# Altium project PRJ-SSDC_meter.PrjPCB
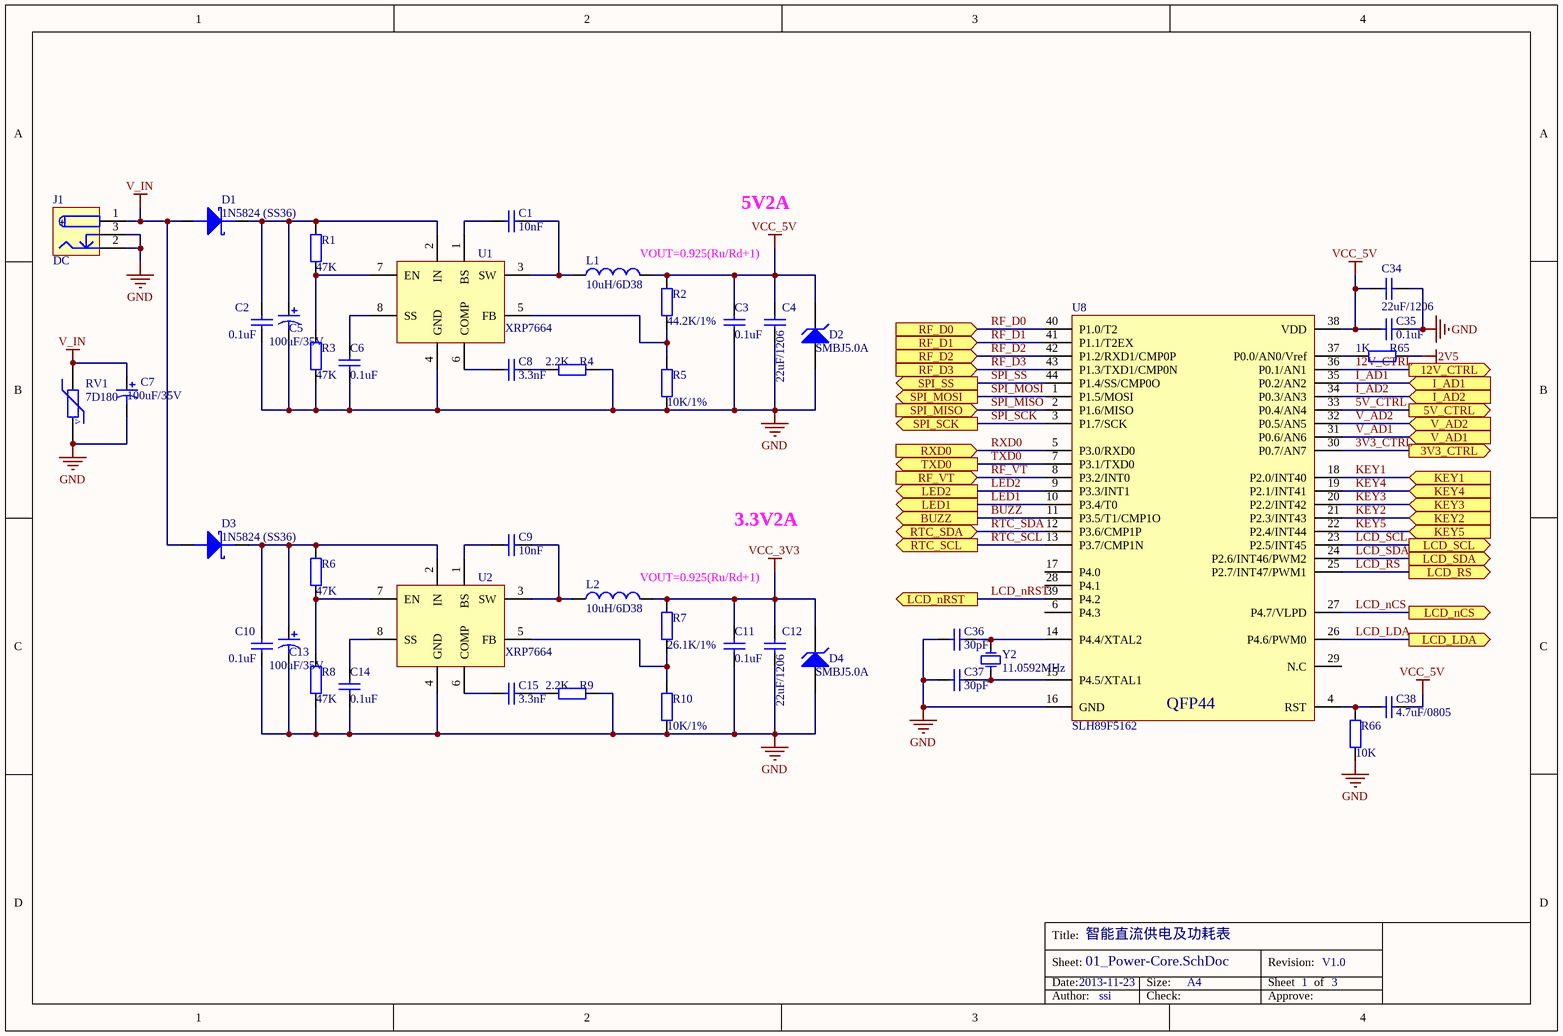
[diagram p0: 01_Power-Core.SchDoc]
3 sheets, 155 parts. Net scope: flat (ports and power ports of the same name join across sheets).
Board file: PCB-SSDCIV_V1.0.PcbDoc
Sheets:
  01_Power-Core.SchDoc
  02_VI-adc.SchDoc
  03_LCD-Other.SchDoc

## Sheet 01_Power-Core.SchDoc
size A4

### Parts
C1  10nF  [0603C]
C2  0.1uF  [0603C]
C3  0.1uF  [0603C]
C4  22uF/1206  [1206]
C5  100uF/35V  [CAP_6.3X11]
C6  0.1uF  [0603C]
C7  100uF/35V  [CAP_6.3X11]
C8  3.3nF  [0603C]
C9  10nF  [0603C]
C10  0.1uF  [0603C]
C11  0.1uF  [0603C]
C12  22uF/1206  [1206]
C13  100uF/35V  [CAP_6.3X11]
C14  0.1uF  [0603C]
C15  3.3nF  [0603C]
C34  22uF/1206  [1206]
C35  0.1uF  [0603C]
C36  30pF  [0603C]
C37  30pF  [0603C]
C38  4.7uF/0805  [0805]
D1  1N5824 (SS36)  [SMA/DO-214AC]
D2  SMBJ5.0A  [SMB/DO-214AB]
D3  1N5824 (SS36)  [SMA/DO-214AC]
D4  SMBJ5.0A  [SMB/DO-214AB]
J1  DC  [DC5.0mm]
L1  10uH/6D38  [INDUCTOR-6D38]
L2  10uH/6D38  [INDUCTOR-6D38]
R1  47K  [0603]
R2  44.2K/1%  [0603]
R3  47K  [0603]
R4  2.2K  [0603]
R5  10K/1%  [0603]
R6  47K  [0603]
R7  26.1K/1%  [0603]
R8  47K  [0603]
R9  2.2K  [0603]
R10  10K/1%  [0603]
R65  1K  [0603]
R66  10K  [0603]
RV1  7D180  [RV2_7D]
U1  XRP7664  [SOIC-8]
U2  XRP7664  [SOIC-8]
U8  SLH89F5162  [LQFP44]
Y2  11.0592MHz  [XTAL]

### Ports
3V3_CTRL (out), 5V_CTRL (out), 12V_CTRL (out), BUZZ (out), I_AD1 (in), I_AD2 (in), KEY1 (in), KEY2 (in), KEY3 (in), KEY4 (in), KEY5 (in), LCD_LDA (out), LCD_nCS (out), LCD_nRST (out), LCD_RS (out), LCD_SCL (out), LCD_SDA (out), LED1 (out), LED2 (out), RF_D0 (in), RF_D1 (in), RF_D2 (in), RF_D3 (in), RF_VT (in), RTC_SCL (out), RTC_SDA (bidir), RXD0 (in), SPI_MISO (in), SPI_MOSI (out), SPI_SCK (out), SPI_SS (out), TXD0 (out), V_AD1 (in), V_AD2 (in)

### Nets
2V5: R65.2
GND: C2.1 C3.1 C4.1 C5.2 C6.1 C7.2 C10.1 C11.1 C12.1 C13.2 C14.1 C34.1 C35.2 C36.1 C37.1 D2.1(A) D4.1(A) J1.2(-) J1.3(W) R3.1 R4.2 R5.1 R8.1 R9.2 R10.1 R66.1 RV1.1 U1.4(GND) U2.4(GND) U8.16(GND)
V_IN: C7.1 D1.1(A) D3.1(A) J1.1(+) RV1.2
VCC_3V3: C11.2 C12.2 D4.2(K) L2.2 R7.2
VCC_5V: C3.2 C4.2 C34.2 C35.1 C38.1 D2.2(K) L1.2 R2.2 U8.38(VDD)
3V3_CTRL: U8.30(P0.7/AN7) ; port 3V3_CTRL
5V_CTRL: U8.33(P0.4/AN4) ; port 5V_CTRL
12V_CTRL: U8.36(P0.1/AN1) ; port 12V_CTRL
BUZZ: U8.11(P3.5/T1/CMP1O) ; port BUZZ
I_AD1: U8.35(P0.2/AN2) ; port I_AD1
I_AD2: U8.34(P0.3/AN3) ; port I_AD2
KEY1: U8.18(P2.0/INT40) ; port KEY1
KEY2: U8.21(P2.3/INT43) ; port KEY2
KEY3: U8.20(P2.2/INT42) ; port KEY3
KEY4: U8.19(P2.1/INT41) ; port KEY4
KEY5: U8.22(P2.4/INT44) ; port KEY5
LCD_LDA: U8.26(P4.6/PWM0) ; port LCD_LDA
LCD_nCS: U8.27(P4.7/VLPD) ; port LCD_nCS
LCD_nRST: U8.39(P4.2) ; port LCD_nRST
LCD_RS: U8.25(P2.7/INT47/PWM1) ; port LCD_RS
LCD_SCL: U8.23(P2.5/INT45) ; port LCD_SCL
LCD_SDA: U8.24(P2.6/INT46/PWM2) ; port LCD_SDA
LED1: U8.10(P3.4/T0) ; port LED1
LED2: U8.9(P3.3/INT1) ; port LED2
RF_D0: U8.40(P1.0/T2) ; port RF_D0
RF_D1: U8.41(P1.1/T2EX) ; port RF_D1
RF_D2: U8.42(P1.2/RXD1/CMP0P) ; port RF_D2
RF_D3: U8.43(P1.3/TXD1/CMP0N) ; port RF_D3
RF_VT: U8.8(P3.2/INT0) ; port RF_VT
RTC_SCL: U8.13(P3.7/CMP1N) ; port RTC_SCL
RTC_SDA: U8.12(P3.6/CMP1P) ; port RTC_SDA
RXD0: U8.5(P3.0/RXD0) ; port RXD0
SPI_MISO: U8.2(P1.6/MISO) ; port SPI_MISO
SPI_MOSI: U8.1(P1.5/MOSI) ; port SPI_MOSI
SPI_SCK: U8.3(P1.7/SCK) ; port SPI_SCK
SPI_SS: U8.44(P1.4/SS/CMP0O) ; port SPI_SS
TXD0: U8.7(P3.1/TXD0) ; port TXD0
V_AD1: U8.31(P0.6/AN6) ; port V_AD1
V_AD2: U8.32(P0.5/AN5) ; port V_AD2
NetC1_1: C1.1 U1.1(BS)
NetC1_2: C1.2 L1.1 U1.3(SW)
NetC2_2: C2.2 C5.1 D1.2(K) R1.2 U1.2(IN)
NetC6_2: C6.2 U1.8(SS)
NetC8_1: C8.1 U1.6(COMP)
NetC8_2: C8.2 R4.1
NetC9_1: C9.1 U2.1(BS)
NetC9_2: C9.2 L2.1 U2.3(SW)
NetC10_2: C10.2 C13.1 D3.2(K) R6.2 U2.2(IN)
NetC14_2: C14.2 U2.8(SS)
NetC15_1: C15.1 U2.6(COMP)
NetC15_2: C15.2 R9.1
NetC36_2: C36.2 U8.14(P4.4/XTAL2) Y2.2(OSC2)
NetC37_2: C37.2 U8.15(P4.5/XTAL1) Y2.1(OSC1)
NetC38_2: C38.2 R66.2 U8.4(RST)
NetR1_1: R1.1 R3.2 U1.7(EN)
NetR2_1: R2.1 R5.2 U1.5(FB)
NetR6_1: R6.1 R8.2 U2.7(EN)
NetR7_1: R7.1 R10.2 U2.5(FB)
NetR65_1: R65.1 U8.37(P0.0/AN0/Vref)

Not connected (* = marked no-connect by the designer): U8 6(P4.3) 17(P4.0) 28(P4.1) 29(N.C)

### Notes on the sheet
- 5V2A
- (near L1) VOUT=0.925(Ru/Rd+1)
- (near L2) VOUT=0.925(Ru/Rd+1)
- 3.3V2A
- 2013-11-23
- 智能直流供电及功耗表
- 1        3
- V1.0
- ssi
- Title:
- Sheet:
- Date:
- Size:
- A4
- Revision:
- Sheet
- of
- Author:
- Check:
- Approve:
- (in symbol RES VDR) V
- (in symbol SLH89F5162_QFP44) QFP44

### Library data of the parts
C1-C4 C6 C8-C12 C14 C15 C34-C38 = Cap: Capacitor; Published: 8-Jun-2000; LatestRevisionDate: 17-Jul-2002; LatestRevisionNote: Re-released for DXP Platform.; PackageReference: RAD-0.3; Publisher: Altium Limited
C5 C7 C13 = Cap2: Capacitor; Published: 23-Sep-2002; PackageReference: CAPR5-4X5; Publisher: Altium Limited
D1 D3 = DIODE_1N582x: Schottky Diode
D2 D4 = DIODE_SMBJxx: Zener Diode; Published: 8-Jun-2000; LatestRevisionDate: 17-Jul-2002; LatestRevisionNote: Re-released for DXP Platform.; PackageReference: DIODE-0.7; Publisher: Altium Limited
J1 = DC_PWR: Low Voltage Power Supply Connector; Published: 17-Dec-2003; DatasheetDocument: 09-May-2002; Publisher: Altium Limited
L1 L2 = Inductor: Code_IEC: 1005; Published: 8-Jun-2000; LatestRevisionDate: 17-Jul-2002; LatestRevisionNote: Re-released for DXP Platform.; PackageReference: 0402-A; Publisher: Altium Limited; Code_JEITA: 0402; Value: Inductor
R1-R10 R65 R66 = Res2: Resistor; Published: 8-Jun-2000; LatestRevisionDate: 17-Jul-2002; LatestRevisionNote: Re-released for DXP Platform.; PackageReference: AXIAL-0.4; Publisher: Altium Limited
RV1 = RES VDR: Varistor (Voltage-Sensitive Resistor) 压敏电阻; Published: 24-Mar-1999; LatestRevisionDate: 04-Mar-2005; LatestRevisionNote: PCB Footprint replaced.; PackageReference: 6-0805; Publisher: Altium Limited
U1 U2 = XRP7664/MP1482: 2A  18V  Synchronous  Step-Down Converter
U8 = SLH89F5162_QFP44
Y2 = XTAL: Crystal Oscillator; Published: 8-Jun-2000; LatestRevisionDate: 17-Jul-2002; LatestRevisionNote: Re-released for DXP Platform.; PackageReference: R38; Publisher: Altium Limited

## Sheet 02_VI-adc.SchDoc
size A4; Organization: Altium Limited; Address1: L3, 12a Rodborough Rd; Address2: Frenchs Forest; Address3: NSW; Address4: Australia 2086
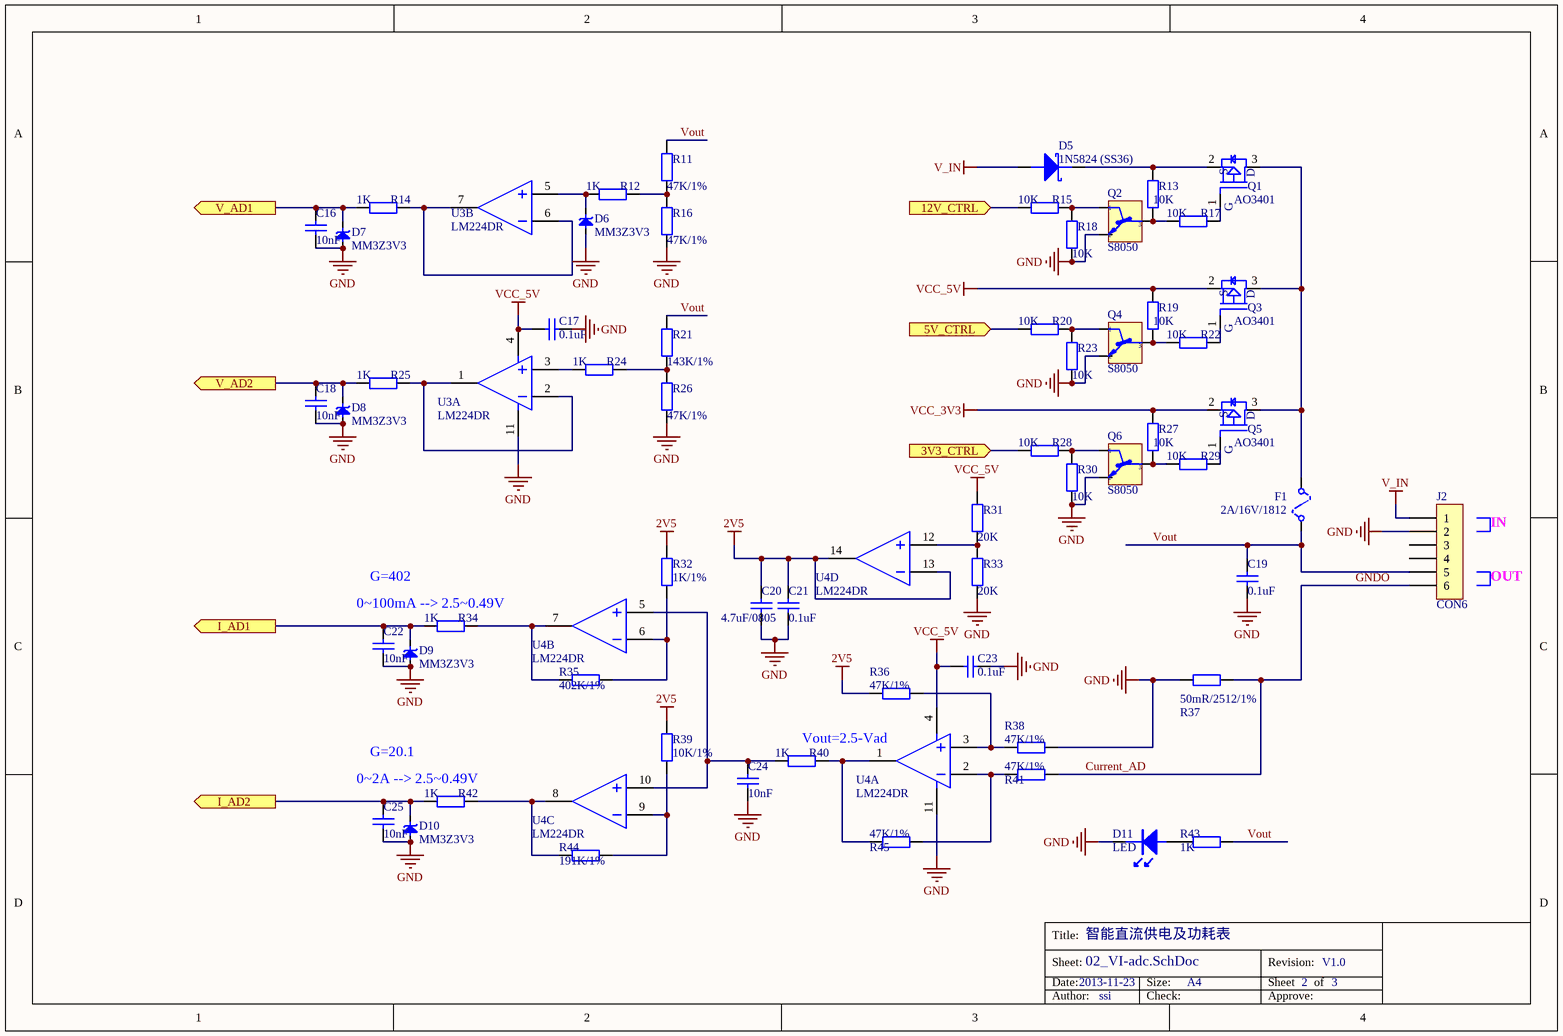
[diagram p1: 02_VI-adc.SchDoc]

### Parts
C16  10nF  [0603C]
C17  0.1uF  [0603C]
C18  10nF  [0603C]
C19  0.1uF  [0603C]
C20  4.7uF/0805  [0805]
C21  0.1uF  [0603C]
C22  10nF  [0603C]
C23  0.1uF  [0603C]
C24  10nF  [0603C]
C25  10nF  [0603C]
D5  1N5824 (SS36)  [SMA/DO-214AC]
D6  MM3Z3V3  [SOD-323]
D7  MM3Z3V3  [SOD-323]
D8  MM3Z3V3  [SOD-323]
D9  MM3Z3V3  [SOD-323]
D10  MM3Z3V3  [SOD-323]
D11  LED  [LED-3.5mm]
F1  2A/16V/1812  [F1812]
J2  CON6  [SIPD6]
Q1  AO3401  [SOT-23]
Q2  S8050  [SOT-23]
Q3  AO3401  [SOT-23]
Q4  S8050  [SOT-23]
Q5  AO3401  [SOT-23]
Q6  S8050  [SOT-23]
R11  47K/1%  [0603]
R12  1K  [0603]
R13  10K  [0603]
R14  1K  [0603]
R15  10K  [0603]
R16  47K/1%  [0603]
R17  10K  [0603]
R18  10K  [0603]
R19  10K  [0603]
R20  10K  [0603]
R21  143K/1%  [0603]
R22  10K  [0603]
R23  10K  [0603]
R24  1K  [0603]
R25  1K  [0603]
R26  47K/1%  [0603]
R27  10K  [0603]
R28  10K  [0603]
R29  10K  [0603]
R30  10K  [0603]
R31  20K  [0603]
R32  1K/1%  [0603]
R33  20K  [0603]
R34  1K  [0603]
R35  402K/1%  [0603]
R36  47K/1%  [0603]
R37  50mR/2512/1%  [2512]
R38  47K/1%  [0603]
R39  10K/1%  [0603]
R40  1K  [0603]
R41  47K/1%  [0603]
R42  1K  [0603]
R43  1K  [0603]
R44  191K/1%  [0603]
R45  47K/1%  [0603]
U3  LM224DR  [SO-14]  (parts A,B of 4)
U4  LM224DR  [SO-14]  (parts A,B,C,D of 4)

### Ports
3V3_CTRL (in), 5V_CTRL (in), 12V_CTRL (in), I_AD1 (out), I_AD2 (out), V_AD1 (out), V_AD2 (out)

### Nets
2V5: C20.2 C21.2 R32.1 R36.1 R39.1 U4.13 U4.14
GND: C16.1 C17.2 C18.1 C19.1 C20.1 C21.1 C22.1 C23.2 C24.1 C25.1 D6.1(A) D7.1(A) D8.1(A) D9.1(A) D10.1(A) D11.2(K) J2.2 Q2.2(E) Q4.2(E) Q6.2(E) R16.1 R18.1 R23.1 R26.1 R30.1 R33.1 R37.1 R38.2 U3.11 U4.11
V_IN: D5.1(A) J2.1
VCC_3V3: Q5.2(S) R27.2
VCC_5V: C17.1 C23.1 Q3.2(S) R19.2 R31.2 U3.4 U4.4
3V3_CTRL: R28.1 ; port 3V3_CTRL
5V_CTRL: R20.1 ; port 5V_CTRL
12V_CTRL: R15.1 ; port 12V_CTRL
Current_AD: J2.6 R37.2 R41.2  [also labelled GNDO]
I_AD1: C22.2 D9.2(K) R34.1 ; port I_AD1
I_AD2: C25.2 D10.2(K) R42.1 ; port I_AD2
V_AD1: C16.2 D7.2(K) R14.1 ; port V_AD1
V_AD2: C18.2 D8.2(K) R25.1 ; port V_AD2
Vout: C19.2 F1.1 J2.5 R11.2 R21.2 R43.2
NetC24_2: C24.2 R40.1 U4.5 U4.10
NetD5_2: D5.2(K) Q1.2(S) R13.2
NetD6_2: D6.2(K) R12.1 U3.5
NetD11_1: D11.1(A) R43.1
NetF1_2: F1.2 Q1.3(D) Q3.3(D) Q5.3(D)
NetQ1_1: Q1.1(G) R17.2
NetQ2_1: Q2.1(B) R15.2 R18.2
NetQ2_3: Q2.3(C) R13.1 R17.1
NetQ3_1: Q3.1(G) R22.2
NetQ4_1: Q4.1(B) R20.2 R23.2
NetQ4_3: Q4.3(C) R19.1 R22.1
NetQ5_1: Q5.1(G) R29.2
NetQ6_1: Q6.1(B) R28.2 R30.2
NetQ6_3: Q6.3(C) R27.1 R29.1
NetR11_1: R11.1 R12.2 R16.2
NetR14_2: R14.2 U3.6 U3.7
NetR21_1: R21.1 R24.2 R26.2
NetR24_1: R24.1 U3.3
NetR25_2: R25.2 U3.1 U3.2
NetR31_1: R31.1 R33.2 U4.12
NetR32_2: R32.2 R35.2 U4.6
NetR34_2: R34.2 R35.1 U4.7
NetR36_2: R36.2 R38.1 U4.3
NetR39_2: R39.2 R44.2 U4.9
NetR40_2: R40.2 R45.1 U4.1
NetR41_1: R41.1 R45.2 U4.2
NetR42_2: R42.2 R44.1 U4.8

Not connected (* = marked no-connect by the designer): J2 3 4

### Notes on the sheet
- G=402
- OUT
- IN
- (near R34) 0~100mA --> 2.5~0.49V
- (near R42) 0~2A --> 2.5~0.49V
- G=20.1
- Vout=2.5-Vad
- 2013-11-23
- 智能直流供电及功耗表
- 2        3
- V1.0
- ssi
- Title:
- Sheet:
- Date:
- Size:
- A4
- Revision:
- Sheet
- of
- Author:
- Check:
- Approve:

### Library data of the parts
C16-C25 = Cap: Capacitor; Published: 8-Jun-2000; LatestRevisionDate: 17-Jul-2002; LatestRevisionNote: Re-released for DXP Platform.; PackageReference: RAD-0.3; Publisher: Altium Limited
D5 = DIODE_1N582x: Schottky Diode
D6-D10 = DIODE_MM3Zxx: Zener Diode; Published: 8-Jun-2000; LatestRevisionDate: 17-Jul-2002; LatestRevisionNote: Re-released for DXP Platform.; PackageReference: DIODE-0.7; Publisher: Altium Limited
F1 = Fuse 3: Fuse; Published: 8-Jun-2000; LatestRevisionDate: 17-Jul-2002; LatestRevisionNote: Re-released for DXP Platform.; PackageReference: PIN-W2/E2.8; Publisher: Altium Limited
Q1 Q3 Q5 = MOS_P_SI2305DS
Q2 Q4 Q6 = NPN_T: NPN
R11-R45 = Res2: Resistor; Published: 8-Jun-2000; LatestRevisionDate: 17-Jul-2002; LatestRevisionNote: Re-released for DXP Platform.; PackageReference: AXIAL-0.4; Publisher: Altium Limited
U3 U4 = LM224

## Sheet 03_LCD-Other.SchDoc
size A4; Organization: Altium Limited; Address1: L3, 12a Rodborough Rd; Address2: Frenchs Forest; Address3: NSW; Address4: Australia 2086
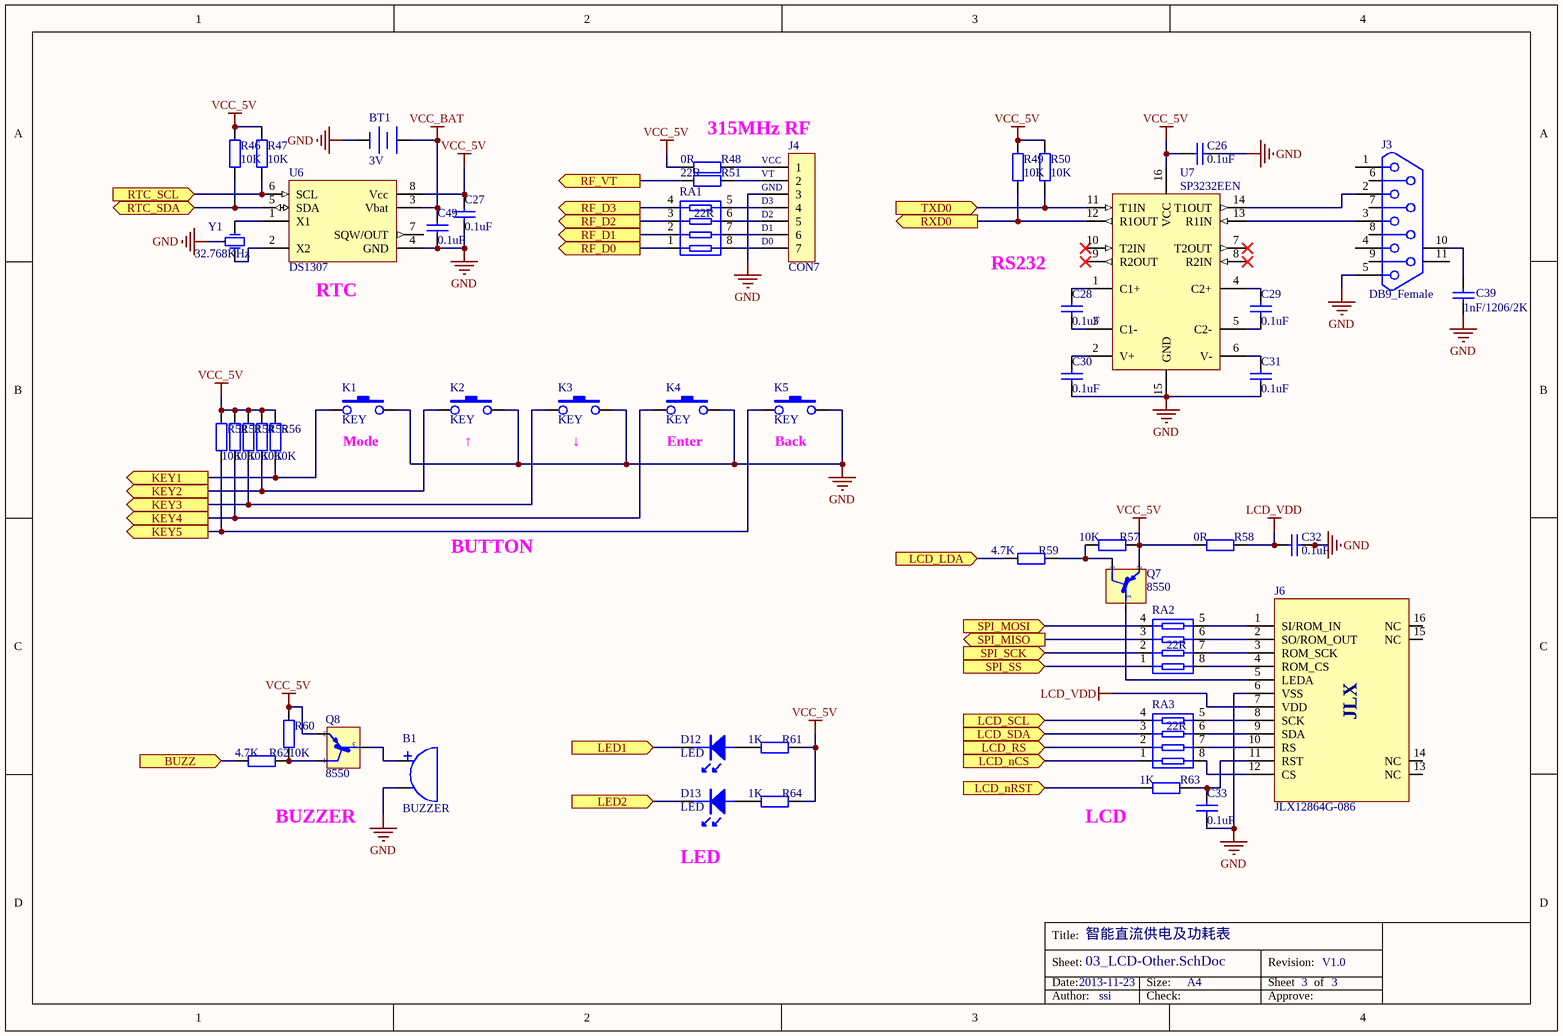
[diagram p2: 03_LCD-Other.SchDoc]

### Parts
B1  BUZZER  [BUZZ]
BT1  3V  [BATTERY_Mi]
C26  0.1uF  [0603C]
C27  0.1uF  [0603C]
C28  0.1uF  [0603C]
C29  0.1uF  [0603C]
C30  0.1uF  [0603C]
C31  0.1uF  [0603C]
C32  0.1uF  [0603C]
C33  0.1uF  [0603C]
C39  1nF/1206/2K  [1206]
C49  0.1uF  [0603C]
D12  LED  [LED-3.5mm]
D13  LED  [LED-3.5mm]
J3  DB9_Female  [DB9_F]
J4  CON7  [SIP7]
J6  JLX12864G-086  [JLX12864G-086]
K1  KEY  [SW_AJ_6X6]
K2  KEY  [SW_AJ_6X6]
K3  KEY  [SW_AJ_6X6]
K4  KEY  [SW_AJ_6X6]
K5  KEY  [SW_AJ_6X6]
Q7  8550  [SOT-23]
Q8  8550  [SOT-23]
R46  10K  [0603]
R47  10K  [0603]
R48  0R  [0603]
R49  10K  [0603]
R50  10K  [0603]
R51  22R  [0603]
R52  10K  [0603]
R53  10K  [0603]
R54  10K  [0603]
R55  10K  [0603]
R56  10K  [0603]
R57  10K  [0603]
R58  0R  [0603]
R59  4.7K  [0603]
R60  10K  [0603]
R61  1K  [0603]
R62  4.7K  [0603]
R63  1K  [0603]
R64  1K  [0603]
RA1  22R  [0603x4]
RA2  22R  [0603x4]
RA3  22R  [0603x4]
U6  DS1307  [SO-8]
U7  SP3232EEN  [SO16]
Y1  32.768KHz  [XTAL-32K-B]

### Ports
BUZZ (in), KEY1 (out), KEY2 (out), KEY3 (out), KEY4 (out), KEY5 (out), LCD_LDA (in), LCD_nCS (in), LCD_nRST (in), LCD_RS (in), LCD_SCL (in), LCD_SDA (in), LED1 (in), LED2 (in), RF_D0 (out), RF_D1 (out), RF_D2 (out), RF_D3 (out), RF_VT (out), RTC_SCL (in), RTC_SDA (bidir), RXD0 (out), SPI_MISO (out), SPI_MOSI (in), SPI_SCK (in), SPI_SS (in), TXD0 (in)

### Nets
GND: B1.2(B) BT1.2(-) C26.1 C27.1 C30.1 C31.1 C32.1 C33.1 C39.1 C49.2 J3.5 J4.3 J6.6(VSS) K1.2 K2.2 K3.2 K4.2 K5.2 U6.4(GND) U7.15(GND) Y1.3
LCD_VDD: C32.2 J6.7(VDD) R58.1
VCC_5V: C26.2 C27.2 Q7.2(E) Q8.2(E) R46.1 R47.1 R48.2 R49.1 R50.1 R52.2 R53.2 R54.2 R55.2 R56.2 R57.1 R58.2 R60.2 R61.2 R64.2 U6.8(Vcc) U7.16(VCC)
VCC_BAT: BT1.1(+) C49.1 U6.3(Vbat)
BUZZ: R62.1 ; port BUZZ
KEY1: K1.1 R56.1 ; port KEY1
KEY2: K2.1 R55.1 ; port KEY2
KEY3: K3.1 R54.1 ; port KEY3
KEY4: K4.1 R53.1 ; port KEY4
KEY5: K5.1 R52.1 ; port KEY5
LCD_LDA: R59.2 ; port LCD_LDA
LCD_nCS: RA3.1 ; port LCD_nCS
LCD_nRST: R63.2 ; port LCD_nRST
LCD_RS: RA3.2 ; port LCD_RS
LCD_SCL: RA3.4 ; port LCD_SCL
LCD_SDA: RA3.3 ; port LCD_SDA
LED1: D12.2(K) ; port LED1
LED2: D13.2(K) ; port LED2
RF_D0: RA1.1 ; port RF_D0
RF_D1: RA1.2 ; port RF_D1
RF_D2: RA1.3 ; port RF_D2
RF_D3: RA1.4 ; port RF_D3
RF_VT: R51.2 ; port RF_VT
RTC_SCL: R47.2 U6.6(SCL) ; port RTC_SCL
RTC_SDA: R46.2 U6.5(SDA) ; port RTC_SDA
RXD0: R49.2 U7.12(R1OUT) ; port RXD0
SPI_MISO: RA2.3 ; port SPI_MISO
SPI_MOSI: RA2.4 ; port SPI_MOSI
SPI_SCK: RA2.2 ; port SPI_SCK
SPI_SS: RA2.1 ; port SPI_SS
TXD0: R50.2 U7.11(T1IN) ; port TXD0
NetB1_1: B1.1(A) Q8.3(C)
NetC28_1: C28.1 U7.3(C1-)
NetC28_2: C28.2 U7.1(C1+)
NetC29_1: C29.1 U7.5(C2-)
NetC29_2: C29.2 U7.4(C2+)
NetC30_2: C30.2 U7.2(V+)
NetC31_2: C31.2 U7.6(V-)
NetC33_2: C33.2 J6.11(RST) R63.1
NetC39_2: C39.2 J3.10
NetD12_1: D12.1(A) R61.1
NetD13_1: D13.1(A) R64.1
NetJ3_2: J3.2 U7.14(T1OUT)
NetJ3_3: J3.3 U7.13(R1IN)
NetJ4_1: J4.1 R48.1
NetJ4_2: J4.2 R51.1
NetJ4_4: J4.4 RA1.5
NetJ4_5: J4.5 RA1.6
NetJ4_6: J4.6 RA1.7
NetJ4_7: J4.7 RA1.8
NetJ6_1: J6.1(SI/ROM_IN) RA2.5
NetJ6_2: J6.2(SO/ROM_OUT) RA2.6
NetJ6_3: J6.3(ROM_SCK) RA2.7
NetJ6_4: J6.4(ROM_CS) RA2.8
NetJ6_5: J6.5(LEDA) Q7.3(C)
NetJ6_8: J6.8(SCK) RA3.5
NetJ6_9: J6.9(SDA) RA3.6
NetJ6_10: J6.10(RS) RA3.7
NetJ6_12: J6.12(CS) RA3.8
NetQ7_1: Q7.1(B) R57.2 R59.1
NetQ8_1: Q8.1(B) R60.1 R62.2
NetU6_1: U6.1(X1) Y1.2(OSC2)
NetU6_2: U6.2(X2) Y1.1(OSC1)

Not connected (* = marked no-connect by the designer): J3 1 4 6 7 8 9 11; J6 13(NC) 14(NC) 15(NC) 16(NC); U6 7(SQW/OUT); U7 7(T2OUT)* 8(R2IN)* 9(R2OUT)* 10(T2IN)*

### Notes on the sheet
- 315MHz RF
- (near J4) VCC
- (near J4) VT
- (near J4) GND
- (near J4) D3
- (near J4) D2
- (near J4) D1
- (near J4) D0
- (near U6) RTC
- (near C28) RS232
- (near K1) Mode
- (near K2) ↑
- (near K3) ↓
- (near K4) Enter
- (near K5) Back
- BUTTON
- BUZZER
- LCD
- LED
- 2013-11-23
- 智能直流供电及功耗表
- 3        3
- V1.0
- ssi
- Title:
- Sheet:
- Date:
- Size:
- A4
- Revision:
- Sheet
- of
- Author:
- Check:
- Approve:
- (in symbol JLX12864G-086) JLX

### Library data of the parts
BT1 = Battery: Multicell Battery; Published: 24-Mar-1999; LatestRevisionDate: 17-Jul-2002; LatestRevisionNote: Re-released for DXP Platform.; PackageReference: BAT-2; Publisher: Altium Limited
C26-C33 C39 C49 = Cap: Capacitor; Published: 8-Jun-2000; LatestRevisionDate: 17-Jul-2002; LatestRevisionNote: Re-released for DXP Platform.; PackageReference: RAD-0.3; Publisher: Altium Limited
J3 = DB9_F: DB9_Female 母
J6 = JLX12864G-086: LCD12864 mini,43.5x40.8mm
K1-K5 = KEY1
Q7 Q8 = PNP_T: PNP
R46-R64 = Res2: Resistor; Published: 8-Jun-2000; LatestRevisionDate: 17-Jul-2002; LatestRevisionNote: Re-released for DXP Platform.; PackageReference: AXIAL-0.4; Publisher: Altium Limited
RA1-RA3 = Res x4: Isolated Resistor Network
U7 = SP3232: 3  to 5V Powered, Multi-Channel RS-232 Driver/Receiver; Published: 16-Jan-2001; LatestRevisionDate: 06-Jun-2005; LatestRevisionNote: Stylized 3D Model Added.; PackageVersion: 1997; PackageReference: PE16A; Publisher: Altium Limited; PackageDescription: DIP; 16 Leads; Row Spacing 7.62 mm; Pitch 2.54 mm; Code_JEDEC: MS-001-BB; ComponentLink1Description: Manufacturer Link; ComponentLink1URL: http://www.maxim-ic.com/; ComponentLink2Description: Datasheet; ComponentLink2URL: http://pdfserv.maxim-ic.com/en/ds/MAX220-MAX249.pdf
Y1 = XTAL32-3: Crystal Oscillator; Published: 8-Jun-2000; LatestRevisionDate: 17-Jul-2002; LatestRevisionNote: Re-released for DXP Platform.; PackageReference: R38; Publisher: Altium Limited

## Nets that join several sheets
2V5: 01_Power-Core (R65.2), 02_VI-adc (7 pins)
GND: 01_Power-Core (30 pins), 02_VI-adc (30 pins), 03_LCD-Other (21 pins)
V_IN: 01_Power-Core (5 pins), 02_VI-adc (D5.1 J2.1)
VCC_3V3: 01_Power-Core (5 pins), 02_VI-adc (Q5.2 R27.2)
VCC_5V: 01_Power-Core (9 pins), 02_VI-adc (7 pins), 03_LCD-Other (21 pins)
3V3_CTRL: 01_Power-Core (U8.30), 02_VI-adc (R28.1)
5V_CTRL: 01_Power-Core (U8.33), 02_VI-adc (R20.1)
12V_CTRL: 01_Power-Core (U8.36), 02_VI-adc (R15.1)
BUZZ: 01_Power-Core (U8.11), 03_LCD-Other (R62.1)
I_AD1: 01_Power-Core (U8.35), 02_VI-adc (C22.2 D9.2 R34.1)
I_AD2: 01_Power-Core (U8.34), 02_VI-adc (C25.2 D10.2 R42.1)
KEY1: 01_Power-Core (U8.18), 03_LCD-Other (K1.1 R56.1)
KEY2: 01_Power-Core (U8.21), 03_LCD-Other (K2.1 R55.1)
KEY3: 01_Power-Core (U8.20), 03_LCD-Other (K3.1 R54.1)
KEY4: 01_Power-Core (U8.19), 03_LCD-Other (K4.1 R53.1)
KEY5: 01_Power-Core (U8.22), 03_LCD-Other (K5.1 R52.1)
LCD_LDA: 01_Power-Core (U8.26), 03_LCD-Other (R59.2)
LCD_nCS: 01_Power-Core (U8.27), 03_LCD-Other (RA3.1)
LCD_nRST: 01_Power-Core (U8.39), 03_LCD-Other (R63.2)
LCD_RS: 01_Power-Core (U8.25), 03_LCD-Other (RA3.2)
LCD_SCL: 01_Power-Core (U8.23), 03_LCD-Other (RA3.4)
LCD_SDA: 01_Power-Core (U8.24), 03_LCD-Other (RA3.3)
LED1: 01_Power-Core (U8.10), 03_LCD-Other (D12.2)
LED2: 01_Power-Core (U8.9), 03_LCD-Other (D13.2)
RF_D0: 01_Power-Core (U8.40), 03_LCD-Other (RA1.1)
RF_D1: 01_Power-Core (U8.41), 03_LCD-Other (RA1.2)
RF_D2: 01_Power-Core (U8.42), 03_LCD-Other (RA1.3)
RF_D3: 01_Power-Core (U8.43), 03_LCD-Other (RA1.4)
RF_VT: 01_Power-Core (U8.8), 03_LCD-Other (R51.2)
RTC_SCL: 01_Power-Core (U8.13), 03_LCD-Other (R47.2 U6.6)
RTC_SDA: 01_Power-Core (U8.12), 03_LCD-Other (R46.2 U6.5)
RXD0: 01_Power-Core (U8.5), 03_LCD-Other (R49.2 U7.12)
SPI_MISO: 01_Power-Core (U8.2), 03_LCD-Other (RA2.3)
SPI_MOSI: 01_Power-Core (U8.1), 03_LCD-Other (RA2.4)
SPI_SCK: 01_Power-Core (U8.3), 03_LCD-Other (RA2.2)
SPI_SS: 01_Power-Core (U8.44), 03_LCD-Other (RA2.1)
TXD0: 01_Power-Core (U8.7), 03_LCD-Other (R50.2 U7.11)
V_AD1: 01_Power-Core (U8.31), 02_VI-adc (C16.2 D7.2 R14.1)
V_AD2: 01_Power-Core (U8.32), 02_VI-adc (C18.2 D8.2 R25.1)